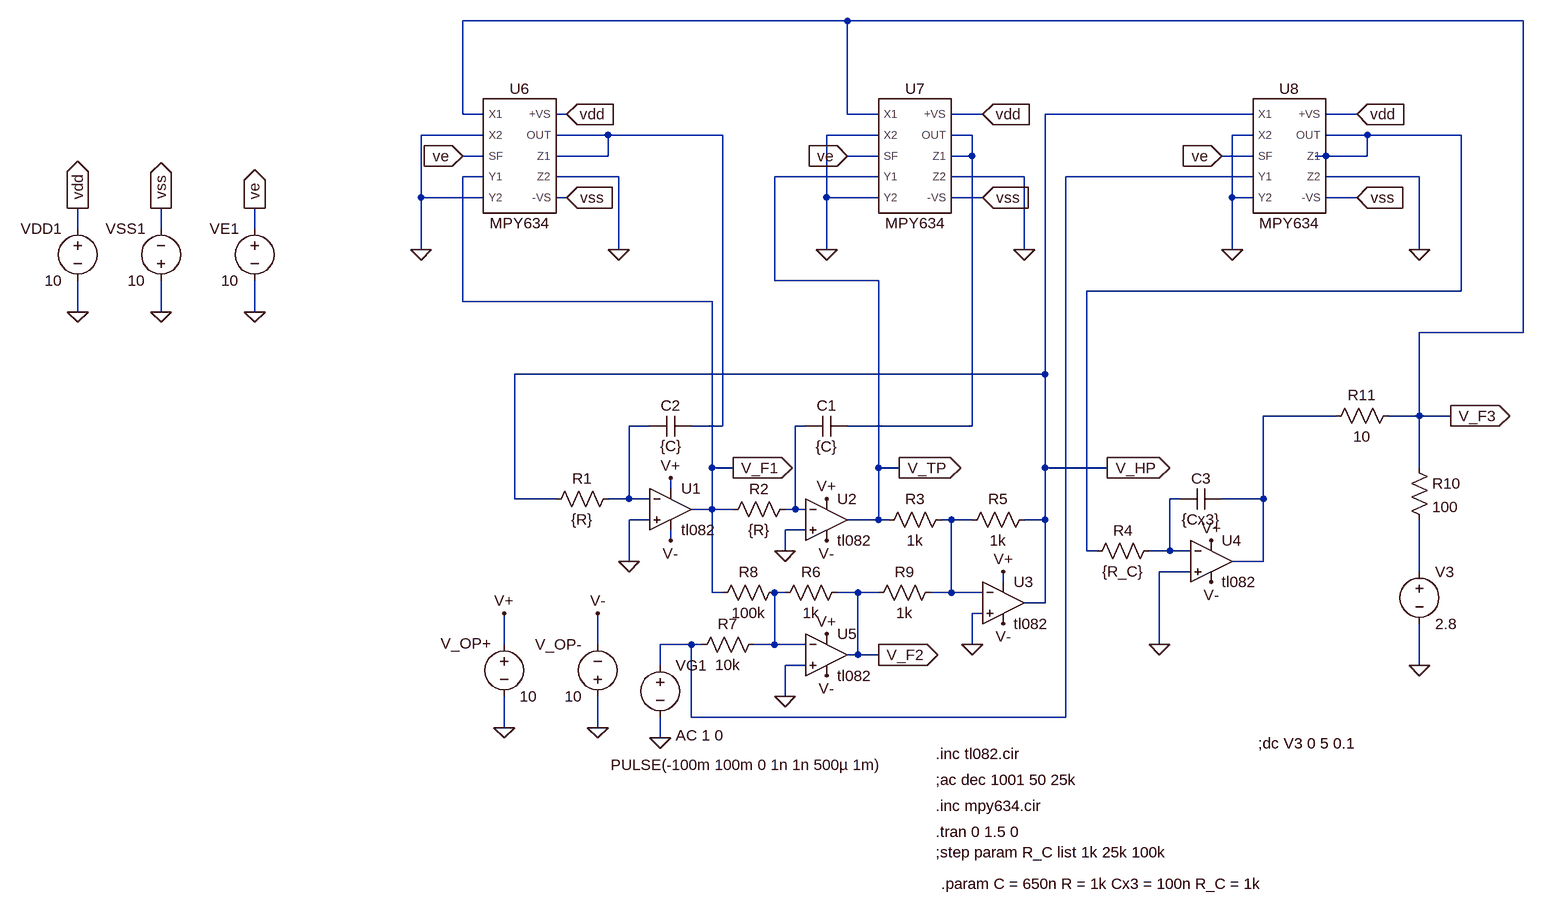
[diagram p0: schematic Experiment_05_DC_VF3.asc]
Experiment_05_DC_VF3.asc, the LTspice schematic file:
Version 4
SHEET 1 2548 696
WIRE 368 -672 -224 -672
WIRE 1408 -672 368 -672
WIRE -224 -528 -224 -672
WIRE -192 -528 -224 -528
WIRE -64 -528 -80 -528
WIRE 368 -528 368 -672
WIRE 416 -528 368 -528
WIRE 576 -528 528 -528
WIRE 992 -528 672 -528
WIRE 1152 -528 1104 -528
WIRE -192 -496 -288 -496
WIRE 0 -496 -80 -496
WIRE 176 -496 0 -496
WIRE 416 -496 336 -496
WIRE 560 -496 528 -496
WIRE 992 -496 960 -496
WIRE 1168 -496 1104 -496
WIRE 1312 -496 1168 -496
WIRE -192 -464 -224 -464
WIRE 0 -464 0 -496
WIRE 0 -464 -80 -464
WIRE 416 -464 368 -464
WIRE 560 -464 560 -496
WIRE 560 -464 528 -464
WIRE 992 -464 944 -464
WIRE 1104 -464 1088 -464
WIRE 1168 -464 1168 -496
WIRE 1168 -464 1104 -464
WIRE -192 -432 -224 -432
WIRE 16 -432 -80 -432
WIRE 416 -432 256 -432
WIRE 640 -432 528 -432
WIRE 992 -432 704 -432
WIRE 1248 -432 1104 -432
WIRE -288 -400 -288 -496
WIRE -192 -400 -288 -400
WIRE -64 -400 -80 -400
WIRE 336 -400 336 -496
WIRE 416 -400 336 -400
WIRE 576 -400 528 -400
WIRE 960 -400 960 -496
WIRE 992 -400 960 -400
WIRE 1152 -400 1104 -400
WIRE -816 -352 -816 -384
WIRE -688 -352 -688 -384
WIRE -544 -352 -544 -384
WIRE -288 -320 -288 -400
WIRE 16 -320 16 -432
WIRE 336 -320 336 -400
WIRE 640 -320 640 -432
WIRE 960 -320 960 -400
WIRE 1248 -320 1248 -432
WIRE 256 -272 256 -432
WIRE 416 -272 256 -272
WIRE 1312 -256 1312 -496
WIRE 1312 -256 736 -256
WIRE -224 -240 -224 -432
WIRE 160 -240 -224 -240
WIRE -816 -224 -816 -272
WIRE -688 -224 -688 -272
WIRE -544 -224 -544 -272
WIRE 1408 -192 1408 -672
WIRE 1408 -192 1248 -192
WIRE 672 -128 672 -528
WIRE 672 -128 -144 -128
WIRE 1120 -64 1008 -64
WIRE 1248 -64 1248 -192
WIRE 1248 -64 1200 -64
WIRE 1296 -64 1248 -64
WIRE 64 -48 32 -48
WIRE 176 -48 176 -496
WIRE 176 -48 128 -48
WIRE 304 -48 288 -48
WIRE 560 -48 560 -464
WIRE 560 -48 368 -48
WIRE 160 16 160 -240
WIRE 192 16 160 16
WIRE 416 16 416 -272
WIRE 448 16 416 16
WIRE 672 16 672 -128
WIRE 768 16 672 16
WIRE 1248 16 1248 -64
WIRE 96 48 96 32
WIRE -144 64 -144 -128
WIRE -80 64 -144 64
WIRE 32 64 32 -48
WIRE 32 64 0 64
WIRE 64 64 32 64
WIRE 880 64 864 64
WIRE 1008 64 1008 -64
WIRE 1008 64 944 64
WIRE 160 80 160 16
WIRE 160 80 128 80
WIRE 192 80 160 80
WIRE 288 80 288 -48
WIRE 288 80 272 80
WIRE 304 80 288 80
WIRE 64 96 32 96
WIRE 416 96 416 16
WIRE 416 96 368 96
WIRE 432 96 416 96
WIRE 528 96 512 96
WIRE 560 96 528 96
WIRE 672 96 672 16
WIRE 672 96 640 96
WIRE 304 112 272 112
WIRE 96 128 96 112
WIRE 272 144 272 112
WIRE 736 144 736 -256
WIRE 752 144 736 144
WIRE 864 144 864 64
WIRE 864 144 832 144
WIRE 896 144 864 144
WIRE 32 160 32 96
WIRE 1008 160 1008 64
WIRE 1008 160 960 160
WIRE 896 176 848 176
WIRE 1248 176 1248 96
WIRE 608 192 608 176
WIRE 160 208 160 80
WIRE 176 208 160 208
WIRE 272 208 256 208
WIRE 384 208 352 208
WIRE 416 208 384 208
WIRE 528 208 528 96
WIRE 528 208 496 208
WIRE 576 208 528 208
WIRE 672 224 672 96
WIRE 672 224 640 224
WIRE 576 240 560 240
WIRE -160 288 -160 240
WIRE -16 288 -16 240
WIRE 128 288 80 288
WIRE 144 288 128 288
WIRE 256 288 256 208
WIRE 256 288 224 288
WIRE 304 288 256 288
WIRE 560 288 560 240
WIRE 848 288 848 176
WIRE 384 304 384 208
WIRE 384 304 368 304
WIRE 416 304 384 304
WIRE 80 320 80 288
WIRE 304 320 272 320
WIRE 1248 320 1248 256
WIRE 272 368 272 320
WIRE 128 400 128 288
WIRE 704 400 704 -432
WIRE 704 400 128 400
WIRE -160 416 -160 368
WIRE -16 416 -16 368
WIRE 80 432 80 400
FLAG 272 368 0
FLAG 560 288 0
FLAG 272 144 0
FLAG 32 160 0
FLAG 80 432 0
FLAG -16 416 0
FLAG -160 416 0
FLAG -160 240 V+
FLAG -16 240 V-
FLAG 96 128 V-
FLAG 336 128 V-
FLAG 608 256 V-
FLAG 336 336 V-
FLAG 96 32 V+
FLAG 336 64 V+
FLAG 608 176 V+
FLAG 336 272 V+
FLAG -816 -224 0
FLAG -688 -224 0
FLAG -544 -224 0
FLAG -816 -384 vdd
IOPIN -816 -384 Out
FLAG -688 -384 vss
IOPIN -688 -384 Out
FLAG -544 -384 ve
IOPIN -544 -384 Out
FLAG -224 -464 ve
IOPIN -224 -464 In
FLAG -64 -528 vdd
IOPIN -64 -528 In
FLAG -64 -400 vss
IOPIN -64 -400 In
FLAG 576 -528 vdd
IOPIN 576 -528 In
FLAG 1152 -528 vdd
IOPIN 1152 -528 In
FLAG 576 -400 vss
IOPIN 576 -400 In
FLAG 1152 -400 vss
IOPIN 1152 -400 In
FLAG 368 -464 ve
IOPIN 368 -464 In
FLAG 944 -464 ve
IOPIN 944 -464 In
FLAG 848 288 0
FLAG 1248 320 0
FLAG -288 -320 0
FLAG 336 -320 0
FLAG 960 -320 0
FLAG 1248 -320 0
FLAG 640 -320 0
FLAG 16 -320 0
FLAG 928 128 V+
FLAG 928 192 V-
FLAG 192 16 V_F1
IOPIN 192 16 Out
FLAG 416 304 V_F2
IOPIN 416 304 Out
FLAG 448 16 V_TP
IOPIN 448 16 Out
FLAG 768 16 V_HP
IOPIN 768 16 Out
FLAG 1296 -64 V_F3
IOPIN 1296 -64 Out
SYMBOL res 16 48 R90
WINDOW 0 0 56 VBottom 2
WINDOW 3 32 56 VTop 2
SYMATTR InstName R1
SYMATTR Value {R}
SYMBOL res 288 64 R90
WINDOW 0 0 56 VBottom 2
WINDOW 3 32 56 VTop 2
SYMATTR InstName R2
SYMATTR Value {R}
SYMBOL res 528 80 R90
WINDOW 0 0 56 VBottom 2
WINDOW 3 32 56 VTop 2
SYMATTR InstName R3
SYMATTR Value 1k
SYMBOL res 656 80 R90
WINDOW 0 0 56 VBottom 2
WINDOW 3 32 56 VTop 2
SYMATTR InstName R5
SYMATTR Value 1k
SYMBOL res 512 192 R90
WINDOW 0 0 56 VBottom 2
WINDOW 3 32 56 VTop 2
SYMATTR InstName R9
SYMATTR Value 1k
SYMBOL res 368 192 R90
WINDOW 0 0 56 VBottom 2
WINDOW 3 32 56 VTop 2
SYMATTR InstName R6
SYMATTR Value 1k
SYMBOL res 272 192 R90
WINDOW 0 0 56 VBottom 2
WINDOW 3 32 56 VTop 2
SYMATTR InstName R8
SYMATTR Value 100k
SYMBOL res 240 272 R90
WINDOW 0 0 56 VBottom 2
WINDOW 3 32 56 VTop 2
SYMATTR InstName R7
SYMATTR Value 10k
SYMBOL cap 128 -64 R90
WINDOW 0 0 32 VBottom 2
WINDOW 3 31 31 VTop 2
SYMATTR InstName C2
SYMATTR Value {C}
SYMBOL cap 368 -64 R90
WINDOW 0 0 32 VBottom 2
WINDOW 3 32 32 VTop 2
SYMATTR InstName C1
SYMATTR Value {C}
SYMBOL voltage 80 304 R0
WINDOW 3 -76 169 Left 2
WINDOW 123 24 124 Left 2
WINDOW 39 0 0 Left 0
SYMATTR Value PULSE(-100m 100m 0 1n 1n 500µ 1m)
SYMATTR Value2 AC 1 0
SYMATTR InstName VG1
SYMBOL voltage -160 272 R0
WINDOW 123 0 0 Left 0
WINDOW 39 0 0 Left 0
WINDOW 0 -98 14 Left 2
SYMATTR InstName V_OP+
SYMATTR Value 10
SYMBOL voltage -16 384 R180
WINDOW 0 24 96 Left 2
WINDOW 3 24 16 Left 2
WINDOW 123 0 0 Left 0
WINDOW 39 0 0 Left 0
SYMATTR InstName V_OP-
SYMATTR Value 10
SYMBOL Opamps\\opamp2 96 16 R0
SYMATTR InstName U1
SYMATTR Value tl082
SYMBOL Opamps\\opamp2 336 32 R0
SYMATTR InstName U2
SYMATTR Value tl082
SYMBOL Opamps\\opamp2 608 160 R0
SYMATTR InstName U3
SYMATTR Value tl082
SYMBOL Opamps\\opamp2 336 240 R0
SYMATTR InstName U5
SYMATTR Value tl082
SYMBOL mpy634 -144 -464 R0
SYMATTR InstName U6
SYMBOL mpy634 464 -464 R0
SYMATTR InstName U7
SYMBOL mpy634 1040 -464 R0
SYMATTR InstName U8
SYMBOL voltage -816 -368 M0
WINDOW 123 0 0 Left 0
WINDOW 39 0 0 Left 0
SYMATTR InstName VDD1
SYMATTR Value 10
SYMBOL voltage -688 -256 R180
WINDOW 0 24 96 Left 2
WINDOW 3 24 16 Left 2
WINDOW 123 0 0 Left 0
WINDOW 39 0 0 Left 0
SYMATTR InstName VSS1
SYMATTR Value 10
SYMBOL voltage -544 -368 M0
WINDOW 123 0 0 Left 0
WINDOW 39 0 0 Left 0
SYMATTR InstName VE1
SYMATTR Value 10
SYMBOL Opamps\\opamp2 928 96 R0
SYMATTR InstName U4
SYMATTR Value tl082
SYMBOL voltage 1248 160 R0
WINDOW 123 0 0 Left 0
WINDOW 39 0 0 Left 0
SYMATTR InstName V3
SYMATTR Value 2.8
SYMBOL res 1232 0 R0
SYMATTR InstName R10
SYMATTR Value 100
SYMBOL res 1216 -80 R90
WINDOW 0 0 56 VBottom 2
WINDOW 3 32 56 VTop 2
SYMATTR InstName R11
SYMATTR Value 10
SYMBOL res 848 128 R90
WINDOW 0 0 56 VBottom 2
WINDOW 3 32 56 VTop 2
SYMATTR InstName R4
SYMATTR Value {R_C}
SYMBOL cap 944 48 R90
WINDOW 0 0 32 VBottom 2
WINDOW 3 32 32 VTop 2
SYMATTR InstName C3
SYMATTR Value {Cx3}
TEXT 504 496 Left 2 !;ac dec 1001 50 25k
TEXT 504 456 Left 2 !.inc tl082.cir
TEXT 504 536 Left 2 !.inc mpy634.cir
TEXT 504 576 Left 2 !.tran 0 1.5 0
TEXT 504 608 Left 2 !;step param R_C list 1k 25k 100k
TEXT 512 656 Left 2 !.param C = 650n R = 1k Cx3 = 100n R_C = 1k
TEXT 1000 440 Left 2 !;dc V3 0 5 0.1

The netlist it stands for:
* Experiment_05_DC_VF3.asc
R1 N006 V_HP {R}
R2 N007 V_F1 {R}
R3 N009 V_TP 1k
R5 V_HP N009 1k
R9 N009 V_F2 1k
R6 V_F2 N011 1k
R8 N011 V_F1 100k
R7 N011 N004 10k
C2 N001 N006 {C}
C1 N002 N007 {C}
VG1 N004 0 PULSE(-100m 100m 0 1n 1n 500µ 1m) AC 1 0
V_OP+ V+ 0 10
V_OP- 0 V- 10
XU1 0 N006 V+ V- V_F1 tl082  ; pins In+ In- V+ V- OUT
XU2 0 N007 V+ V- V_TP tl082  ; pins In+ In- V+ V- OUT
XU3 0 N009 V+ V- V_HP tl082  ; pins In+ In- V+ V- OUT
XU5 0 N011 V+ V- V_F2 tl082  ; pins In+ In- V+ V- OUT
XU6 V_F3 0 ve V_F1 0 vdd N001 N001 0 vss MPY634  ; pins X1 X2 SF Y1 Y2 +VS OUT Z1 Z2 -VS
XU7 V_F3 0 ve V_TP 0 vdd N002 N002 0 vss MPY634  ; pins X1 X2 SF Y1 Y2 +VS OUT Z1 Z2 -VS
XU8 V_HP 0 ve N004 0 vdd N003 N003 0 vss MPY634  ; pins X1 X2 SF Y1 Y2 +VS OUT Z1 Z2 -VS
VDD1 vdd 0 10
VSS1 0 vss 10
VE1 ve 0 10
XU4 0 N008 V+ V- N005 tl082  ; pins In+ In- V+ V- OUT
V3 N010 0 2.8
R10 V_F3 N010 100
R11 V_F3 N005 10
R4 N008 N003 {R_C}
C3 N005 N008 {Cx3}
;ac dec 1001 50 25k
.inc tl082.cir
.inc mpy634.cir
.tran 0 1.5 0
;step param R_C list 1k 25k 100k
.param C = 650n R = 1k Cx3 = 100n R_C = 1k
;dc V3 0 5 0.1
.lib Z:\Users\mimeiners\Documents\courses\ans\lab\ASLK_PRO\docs\spice\Experiment_06\mpy634.cir
.backanno
.end